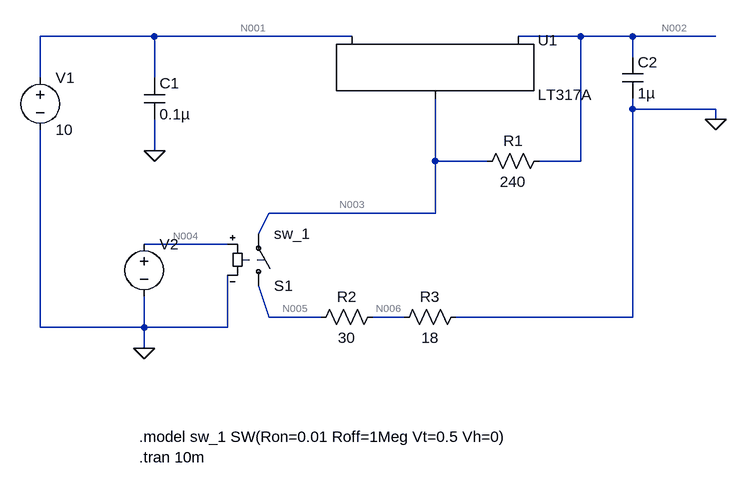
[diagram p0: schematic Sim.asc]
Sim.asc, the LTspice schematic file:
Version 4.1
SHEET 1 880 680
WIRE -304 -80 -480 -80
WIRE 0 -80 -304 -80
WIRE 352 -80 256 -80
WIRE 432 -80 352 -80
WIRE 560 -80 432 -80
WIRE 432 -48 432 -80
WIRE -480 -16 -480 -80
WIRE -304 -16 -304 -80
WIRE 432 32 432 16
WIRE 560 32 432 32
WIRE 560 48 560 32
WIRE -304 96 -304 48
WIRE 128 112 128 16
WIRE 208 112 128 112
WIRE 352 112 352 -80
WIRE 352 112 288 112
WIRE 128 192 128 112
WIRE 128 192 -128 192
WIRE -144 224 -128 192
WIRE -192 240 -320 240
WIRE -128 352 -144 304
WIRE -48 352 -128 352
WIRE 80 352 32 352
WIRE 432 352 432 32
WIRE 432 352 160 352
WIRE -480 368 -480 64
WIRE -320 368 -320 320
WIRE -320 368 -480 368
WIRE -192 368 -192 288
WIRE -192 368 -320 368
WIRE -320 400 -320 368
FLAG -304 96 0
FLAG -320 400 0
FLAG 560 48 0
SYMBOL voltage -480 -32 R0
WINDOW 123 0 0 Left 0
WINDOW 39 0 0 Left 0
SYMATTR InstName V1
SYMATTR Value 10
SYMBOL PowerProducts\\LT317A 128 -80 R0
SYMATTR InstName U1
SYMBOL cap -320 -16 R0
SYMATTR InstName C1
SYMATTR Value 0.1µ
SYMBOL res 304 96 R90
WINDOW 0 0 56 VBottom 2
WINDOW 3 32 56 VTop 2
SYMATTR InstName R1
SYMATTR Value 240
SYMBOL res 48 336 R90
WINDOW 0 0 56 VBottom 2
WINDOW 3 32 56 VTop 2
SYMATTR InstName R2
SYMATTR Value 30
SYMBOL res 176 336 R90
WINDOW 0 0 56 VBottom 2
WINDOW 3 32 56 VTop 2
SYMATTR InstName R3
SYMATTR Value 18
SYMBOL voltage -320 224 R0
WINDOW 3 -5 295 Invisible 2
WINDOW 123 0 0 Left 0
WINDOW 39 0 0 Left 0
SYMATTR Value PULSE(0 1 0 1n 1n 1m 2m)
SYMATTR InstName V2
SYMBOL sw -144 320 M180
SYMATTR InstName S1
SYMATTR Value sw_1
SYMBOL cap 416 -48 R0
SYMATTR InstName C2
SYMATTR Value 1µ
TEXT -328 568 Left 2 !.tran 10m
TEXT -328 536 Left 2 !.model sw_1 SW(Ron=0.01 Roff=1Meg Vt=0.5 Vh=0)

The netlist it stands for:
* Sim.asc
V1 N001 0 10
X§U1 N003 N002 N001 LT317A
C1 N001 0 0.1µ
R1 N002 N003 240
R2 N006 N005 30
R3 0 N006 18
V2 N004 0 PULSE(0 1 0 1n 1n 1m 2m)
S1 N005 N003 N004 0 sw_1
C2 N002 0 1µ
.tran 10m
.model sw_1 SW(Ron=0.01 Roff=1Meg Vt=0.5 Vh=0)
.lib LTC.lib
.backanno
.end

* Results of the author's LTspice run, read from the files saved beside the schematic
* Operating Point, zero values left out:
*   V(n001) = 10 V
*   V(n002) = 9.973 V
*   V(n003) = 9.971 V
*   V(n005) = 478.6 µV
*   V(n006) = 179.5 µV
*   I(R1) = 9.971 µA
*   I(R2) = -9.971 µA
*   I(R3) = -9.971 µA
*   I(S1) = 9.971 µA
*   I(V1) = -9.969 µA
*   Ix(u1:2) = -9.969 µA
*   Ix(u1:3) = 9.969 µA
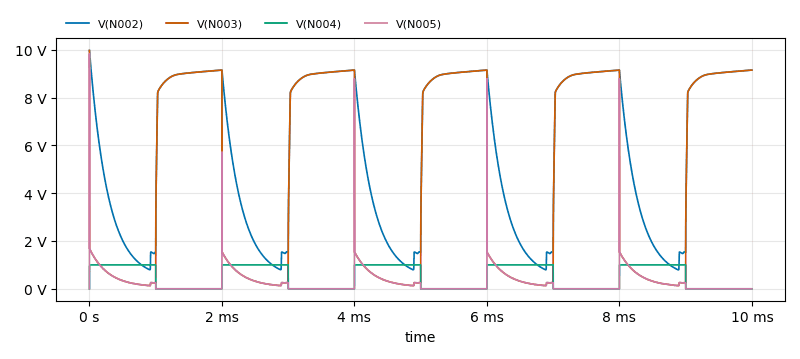
[diagram p1: Transient Analysis of Sim.asc, plotted from the saved traces]
* Transient Analysis, 1 run:
*   V(N002): min 791.1 mV, max 9.973 V, average 5.887 V, rms 6.795 V, last 9.151 V
*   V(N003): min 132.2 mV, max 9.971 V, average 4.672 V, rms 6.294 V, last 9.149 V
*   V(N004): min 0 V, max 1 V, average 500 mV, rms 707.1 mV, last 0 V
*   V(N005): min 17.43 µV, max 9.831 V, average 246.3 mV, rms 438 mV, last 439.1 µV